# Altium schematic sheet power.SchDoc: Daughterboard Power
size A; DrawnBy: Mike Mozingo; Engineer: Mike Mozingo; Revision: 1